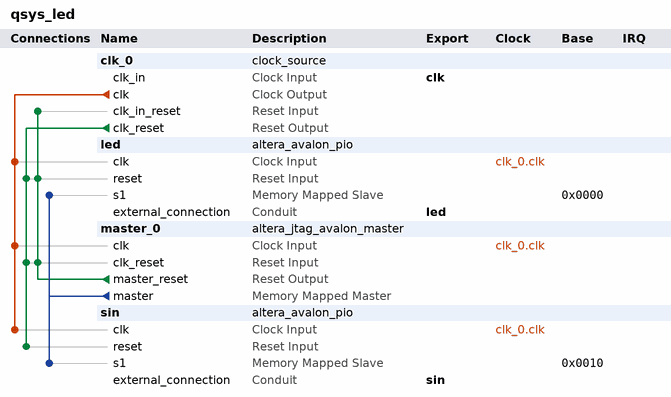
[diagram p0: system contents]
# Platform Designer (Qsys) system qsys_led, Cyclone V 5CSEBA6U23I7
# Parameters at their usual value, and those the tool derives, are not listed.
package require -exact qsys 17.1
create_system qsys_led
set_project_property DEVICE_FAMILY {Cyclone V}
set_project_property DEVICE 5CSEBA6U23I7

add_instance clk_0 clock_source 17.1
set_instance_parameter_value clk_0 clockFrequency 50000000

add_instance led altera_avalon_pio 17.1
set_instance_parameter_value led direction Output
set_instance_parameter_value led width 16

add_instance master_0 altera_jtag_avalon_master 17.1

add_instance sin altera_avalon_pio 17.1
set_instance_parameter_value sin direction Input
set_instance_parameter_value sin simDoTestBenchWiring true
set_instance_parameter_value sin width 16

# connections
add_connection clk_0.clk led.clk clock
add_connection clk_0.clk master_0.clk clock
add_connection clk_0.clk sin.clk clock
add_connection clk_0.clk_reset led.reset reset
add_connection clk_0.clk_reset master_0.clk_reset reset
add_connection clk_0.clk_reset sin.reset reset
add_connection master_0.master_reset clk_0.clk_in_reset reset
add_connection master_0.master_reset led.reset reset
add_connection master_0.master_reset master_0.clk_reset reset
add_connection master_0.master led.s1 avalon
set_connection_parameter_value master_0.master/led.s1 baseAddress 0x0000
add_connection master_0.master sin.s1 avalon
set_connection_parameter_value master_0.master/sin.s1 baseAddress 0x0010

# exported interfaces
add_interface clk clock sink
set_interface_property clk EXPORT_OF clk_0.clk_in
add_interface led conduit end
set_interface_property led EXPORT_OF led.external_connection
add_interface sin conduit end
set_interface_property sin EXPORT_OF sin.external_connection

set_interconnect_requirement {$system} qsys_mm.clockCrossingAdapter HANDSHAKE
set_interconnect_requirement {$system} qsys_mm.maxAdditionalLatency 1

save_system qsys_led.qsys
